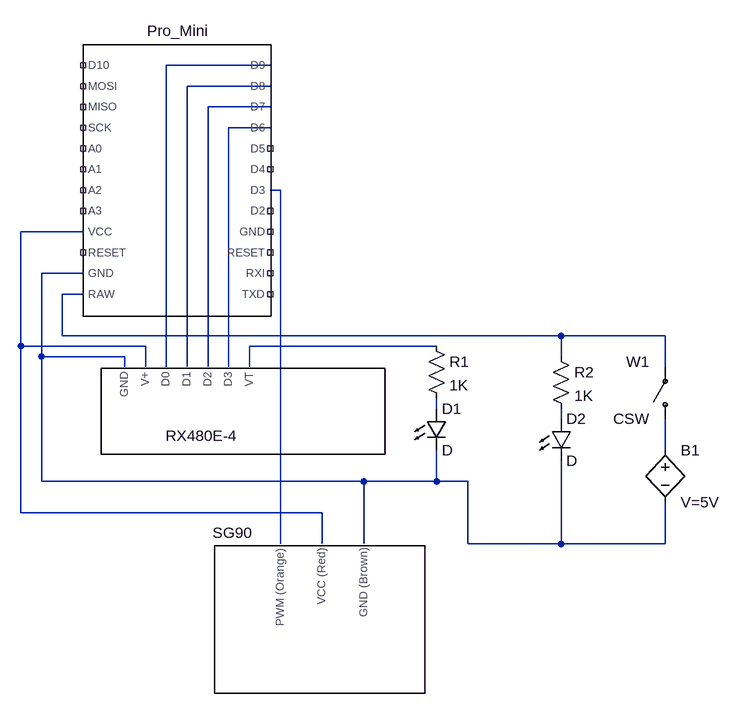
[diagram p0: schematic LightSwitch.asc]
LightSwitch.asc, the LTspice schematic file:
Version 4
SHEET 1 1060 944
WIRE 320 -112 160 -112
WIRE 320 -80 192 -80
WIRE 320 -48 224 -48
WIRE 320 -16 256 -16
WIRE 336 80 320 80
WIRE 32 144 -64 144
WIRE 32 208 -32 208
WIRE 32 240 0 240
WIRE 0 304 0 240
WIRE 768 304 0 304
WIRE 928 304 768 304
WIRE -64 320 -64 144
WIRE 128 320 -64 320
WIRE 576 320 288 320
WIRE -32 336 -32 208
WIRE 96 336 -32 336
WIRE 768 336 768 304
WIRE 96 352 96 336
WIRE 128 352 128 320
WIRE 160 352 160 -112
WIRE 192 352 192 -80
WIRE 224 352 224 -48
WIRE 256 352 256 -16
WIRE 288 352 288 320
WIRE 928 352 928 304
WIRE 576 416 576 400
WIRE 768 432 768 416
WIRE 928 480 928 432
WIRE -32 528 -32 336
WIRE 464 528 -32 528
WIRE 576 528 576 480
WIRE 576 528 464 528
WIRE 624 528 576 528
WIRE -64 576 -64 320
WIRE 400 576 -64 576
WIRE 336 624 336 80
WIRE 400 624 400 576
WIRE 464 624 464 528
WIRE 624 624 624 528
WIRE 768 624 768 496
WIRE 768 624 624 624
WIRE 928 624 928 560
WIRE 928 624 768 624
SYMBOL Arduino\ Pro\ Mini 176 240 R180
WINDOW 0 -50 405 Left 2
SYMATTR InstName Pro_Mini
SYMBOL RX480E-4 304 352 R0
WINDOW 0 -145 106 Left 2
SYMATTR InstName RX480E-4
SYMBOL SG90 400 736 R270
WINDOW 0 129 -169 VRight 2
SYMATTR InstName SG90
SYMBOL csw 928 432 R180
WINDOW 0 24 88 Left 2
WINDOW 3 24 0 Left 2
SYMATTR InstName W1
SYMBOL bv 928 464 R0
SYMATTR InstName B1
SYMATTR Value V=5V
SYMBOL LED 560 416 R0
SYMATTR InstName D1
SYMBOL LED 752 432 R0
SYMATTR InstName D2
SYMBOL res 560 304 R0
SYMATTR InstName R1
SYMATTR Value 1K
SYMATTR SpiceLine tol=1 pwr=0.1
SYMBOL res 752 320 R0
SYMATTR InstName R2
SYMATTR Value 1K
SYMATTR SpiceLine tol=1 pwr=0.1

The netlist it stands for:
* LightSwitch.asc
XPro_Mini NC_01 NC_02 NC_03 NC_04 NC_05 N005 NC_06 NC_07 N004 N003 N002 N001 NC_08 NC_09 NC_10 NC_11 NC_12 NC_13 NC_14 NC_15 N006 NC_16 N007 N008 Arduino Pro Mini  ; pins TXD RXI RESET GND D2 D3 D4 D5 D6 D7 D8 D9 D10 MOSI MISO SCK A0 A1 A2 A3 VCC RESET GND RAW
XRX480E-4 N007 N006 N001 N002 N003 N004 N009 RX480E-4  ; pins GND V+ D0 D1 D2 D3 VT
XSG90 N005 N006 N007 SG90  ; pins PWM_(Orange) VCC_(Red) GND_(Brown)
W1 N012 N008 CSW
B1 N012 N007 V=5V
D1 N010 N007 D
D2 N011 N007 D
R1 N009 N010 1K tol=1 pwr=0.1
R2 N008 N011 1K tol=1 pwr=0.1
.model D D
.lib standard.dio
.backanno
.end